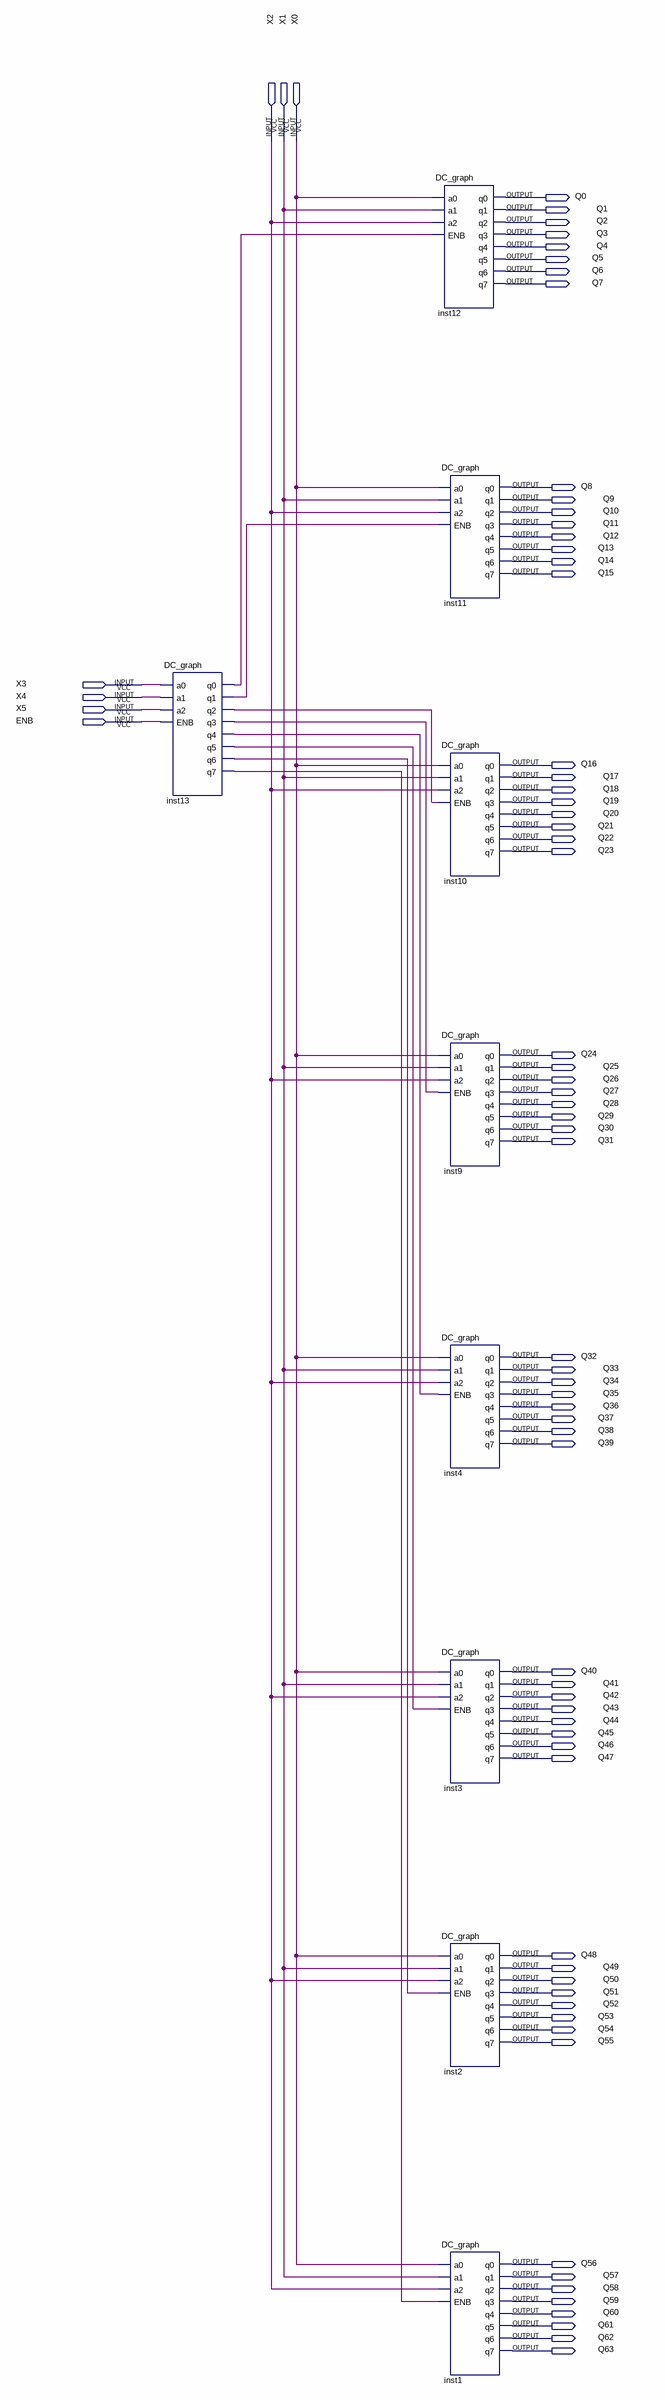
[diagram p0: schematic sheet]
// Quartus schematic DC_2bit.bdf as structural Verilog: 9 symbols, 71 pins
module DC_2bit (
  input  X2,
  input  X1,
  input  X0,
  input  X3,
  input  X4,
  input  X5,
  input  ENB,
  output Q0,
  output Q1,
  output Q2,
  output Q3,
  output Q4,
  output Q5,
  output Q6,
  output Q7,
  output Q8,
  output Q9,
  output Q10,
  output Q11,
  output Q12,
  output Q13,
  output Q14,
  output Q15,
  output Q16,
  output Q17,
  output Q18,
  output Q19,
  output Q20,
  output Q21,
  output Q22,
  output Q23,
  output Q24,
  output Q25,
  output Q26,
  output Q27,
  output Q28,
  output Q29,
  output Q30,
  output Q31,
  output Q32,
  output Q33,
  output Q34,
  output Q35,
  output Q36,
  output Q37,
  output Q38,
  output Q39,
  output Q40,
  output Q41,
  output Q42,
  output Q43,
  output Q44,
  output Q45,
  output Q46,
  output Q47,
  output Q48,
  output Q49,
  output Q50,
  output Q51,
  output Q52,
  output Q53,
  output Q54,
  output Q55,
  output Q56,
  output Q57,
  output Q58,
  output Q59,
  output Q60,
  output Q61,
  output Q62,
  output Q63
);

  wire inst13_q0, inst13_q1, inst13_q2, inst13_q3, inst13_q4, inst13_q5, inst13_q6, inst13_q7;

  DC_graph inst13 (
    .a0(X3), .a1(X4), .a2(X5), .ENB(ENB), .q0(inst13_q0), .q1(inst13_q1), .q2(inst13_q2), .q3(inst13_q3),
    .q4(inst13_q4), .q5(inst13_q5), .q6(inst13_q6), .q7(inst13_q7));
  DC_graph inst12 (
    .a0(X0), .a1(X1), .a2(X2), .ENB(inst13_q0), .q0(Q0), .q1(Q1), .q2(Q2), .q3(Q3), .q4(Q4), .q5(Q5),
    .q6(Q6), .q7(Q7));
  DC_graph inst11 (
    .a0(X0), .a1(X1), .a2(X2), .ENB(inst13_q1), .q0(Q8), .q1(Q9), .q2(Q10), .q3(Q11), .q4(Q12), .q5(Q13),
    .q6(Q14), .q7(Q15));
  DC_graph inst10 (
    .a0(X0), .a1(X1), .a2(X2), .ENB(inst13_q2), .q0(Q16), .q1(Q17), .q2(Q18), .q3(Q19), .q4(Q20), .q5(Q21),
    .q6(Q22), .q7(Q23));
  DC_graph inst9 (
    .a0(X0), .a1(X1), .a2(X2), .ENB(inst13_q3), .q0(Q24), .q1(Q25), .q2(Q26), .q3(Q27), .q4(Q28), .q5(Q29),
    .q6(Q30), .q7(Q31));
  DC_graph inst4 (
    .a0(X0), .a1(X1), .a2(X2), .ENB(inst13_q4), .q0(Q32), .q1(Q33), .q2(Q34), .q3(Q35), .q4(Q36), .q5(Q37),
    .q6(Q38), .q7(Q39));
  DC_graph inst3 (
    .a0(X0), .a1(X1), .a2(X2), .ENB(inst13_q5), .q0(Q40), .q1(Q41), .q2(Q42), .q3(Q43), .q4(Q44), .q5(Q45),
    .q6(Q46), .q7(Q47));
  DC_graph inst2 (
    .a0(X0), .a1(X1), .a2(X2), .ENB(inst13_q6), .q0(Q48), .q1(Q49), .q2(Q50), .q3(Q51), .q4(Q52), .q5(Q53),
    .q6(Q54), .q7(Q55));
  DC_graph inst1 (
    .a0(X0), .a1(X1), .a2(X2), .ENB(inst13_q7), .q0(Q56), .q1(Q57), .q2(Q58), .q3(Q59), .q4(Q60), .q5(Q61),
    .q6(Q62), .q7(Q63));
endmodule
